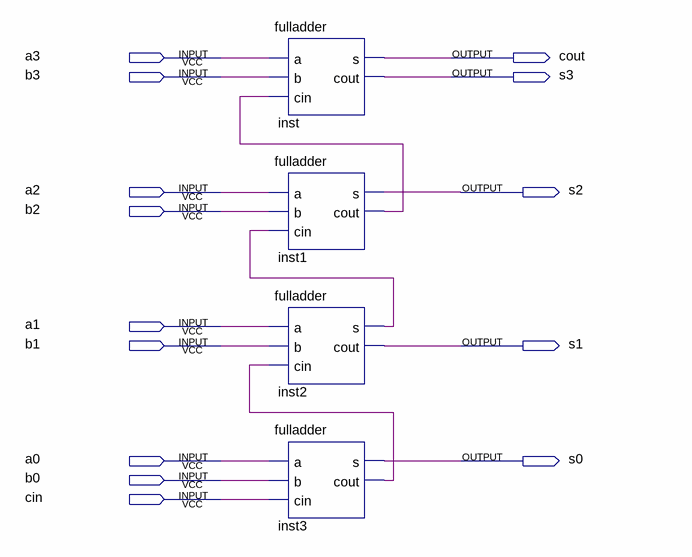
[diagram p0: schematic sheet]
// Quartus schematic 4bitadder.bdf as structural Verilog: 4 symbols, 14 pins
module \4bitadder  (
  input  a3,
  input  b3,
  input  a2,
  input  b2,
  input  a1,
  input  b1,
  input  a0,
  input  b0,
  input  cin,
  output cout,
  output s3,
  output s2,
  output s1,
  output s0
);

  wire inst1_cout, inst2_s, inst3_cout;

  fulladder inst (.a(a3), .b(b3), .cin(inst1_cout), .s(cout), .cout(s3));
  fulladder inst1 (.a(a2), .b(b2), .cin(inst2_s), .s(s2), .cout(inst1_cout));
  fulladder inst2 (.a(a1), .b(b1), .cin(inst3_cout), .s(inst2_s), .cout(s1));
  fulladder inst3 (.a(a0), .b(b0), .cin(cin), .s(s0), .cout(inst3_cout));
endmodule
